# Altium schematic sheet OPAMP_resistors.SchDoc
size A
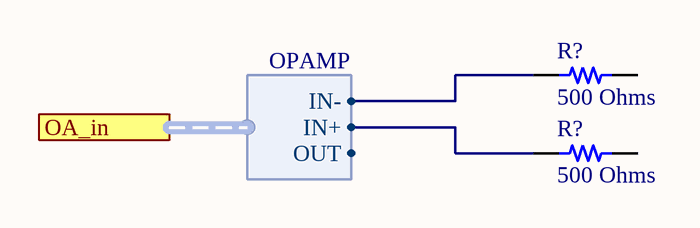
[diagram p0: OPAMP_resistors.SchDoc]

## Parts
(Parts that share a designator on the sheet are numbered #1, #2 ... from top to bottom, then left to right.)
R?#1  500 Ohms  [RES 0603_1608]
R?#2  500 Ohms  [RES 0603_1608]

## Ports
OA_in (harness OPAMP)

## Harnesses
OPAMP: IN-, IN+, OUT

## Nets
NetR?#1_1: R?#1.1 ; port OA_in.IN-
NetR?#2_1: R?#2.1 ; port OA_in.IN+

Not connected (* = marked no-connect by the designer): R?#1 2; R?#2 2

## Library data of the parts
R?#1 R?#2 = TNPU0603500RAZEN00: RES SMD 500 OHM 0.05% 1/10W 0603; Manufacturer: Vishay Dale; Power (Watts): 0.1W, 1/10W; Temperature Coefficient: ±5ppm/°C; Part Number: TNPU0603500RAZEN00; Value: 500 Ohms; ComponentLink1Description: Datasheet; ComponentLink1URL: http://www.vishay.com/docs/28779/tnpue3.pdf; ComponentLink2Description: DigiKey Link; ComponentLink2URL: http://digikey.com/product-detail/en/vishay-dale/TNPU0603500RAZEN00/541-3301-1-ND/6615958; Composition: Thin Film; Device Package: 0603 (1608 Metric); Features: Anti-Sulfur, Automotive AEC-Q200, Moisture Resistant; Height - Seated (Max): 0.022" (0.55mm); LastUpdated: 13-Aug-20 10:37:00 AM; Lifecycle Status: Active; Minimum Order: 1; Number of Terminations: 2; Operating Temperature: -55°C ~ 125°C; Package / Case: 0603 (1608 Metric); Packaging: TapeAndReel; PartId: 11840; Part Status: Active; Price: 1.20; Ratings: AEC-Q200; Resistance: 500 Ohms; Series: TNPU; Size / Dimension: 0.063" L x 0.033" W (1.60mm x 0.85mm); Supplier 1: DigiKey; Supplier Part Number 1: 541-3301-1-ND; Supplier Device Package: 0603; Tolerance: ±0.05%